# EAGLE design module-basic-ui (EAGLE 7.7.0)
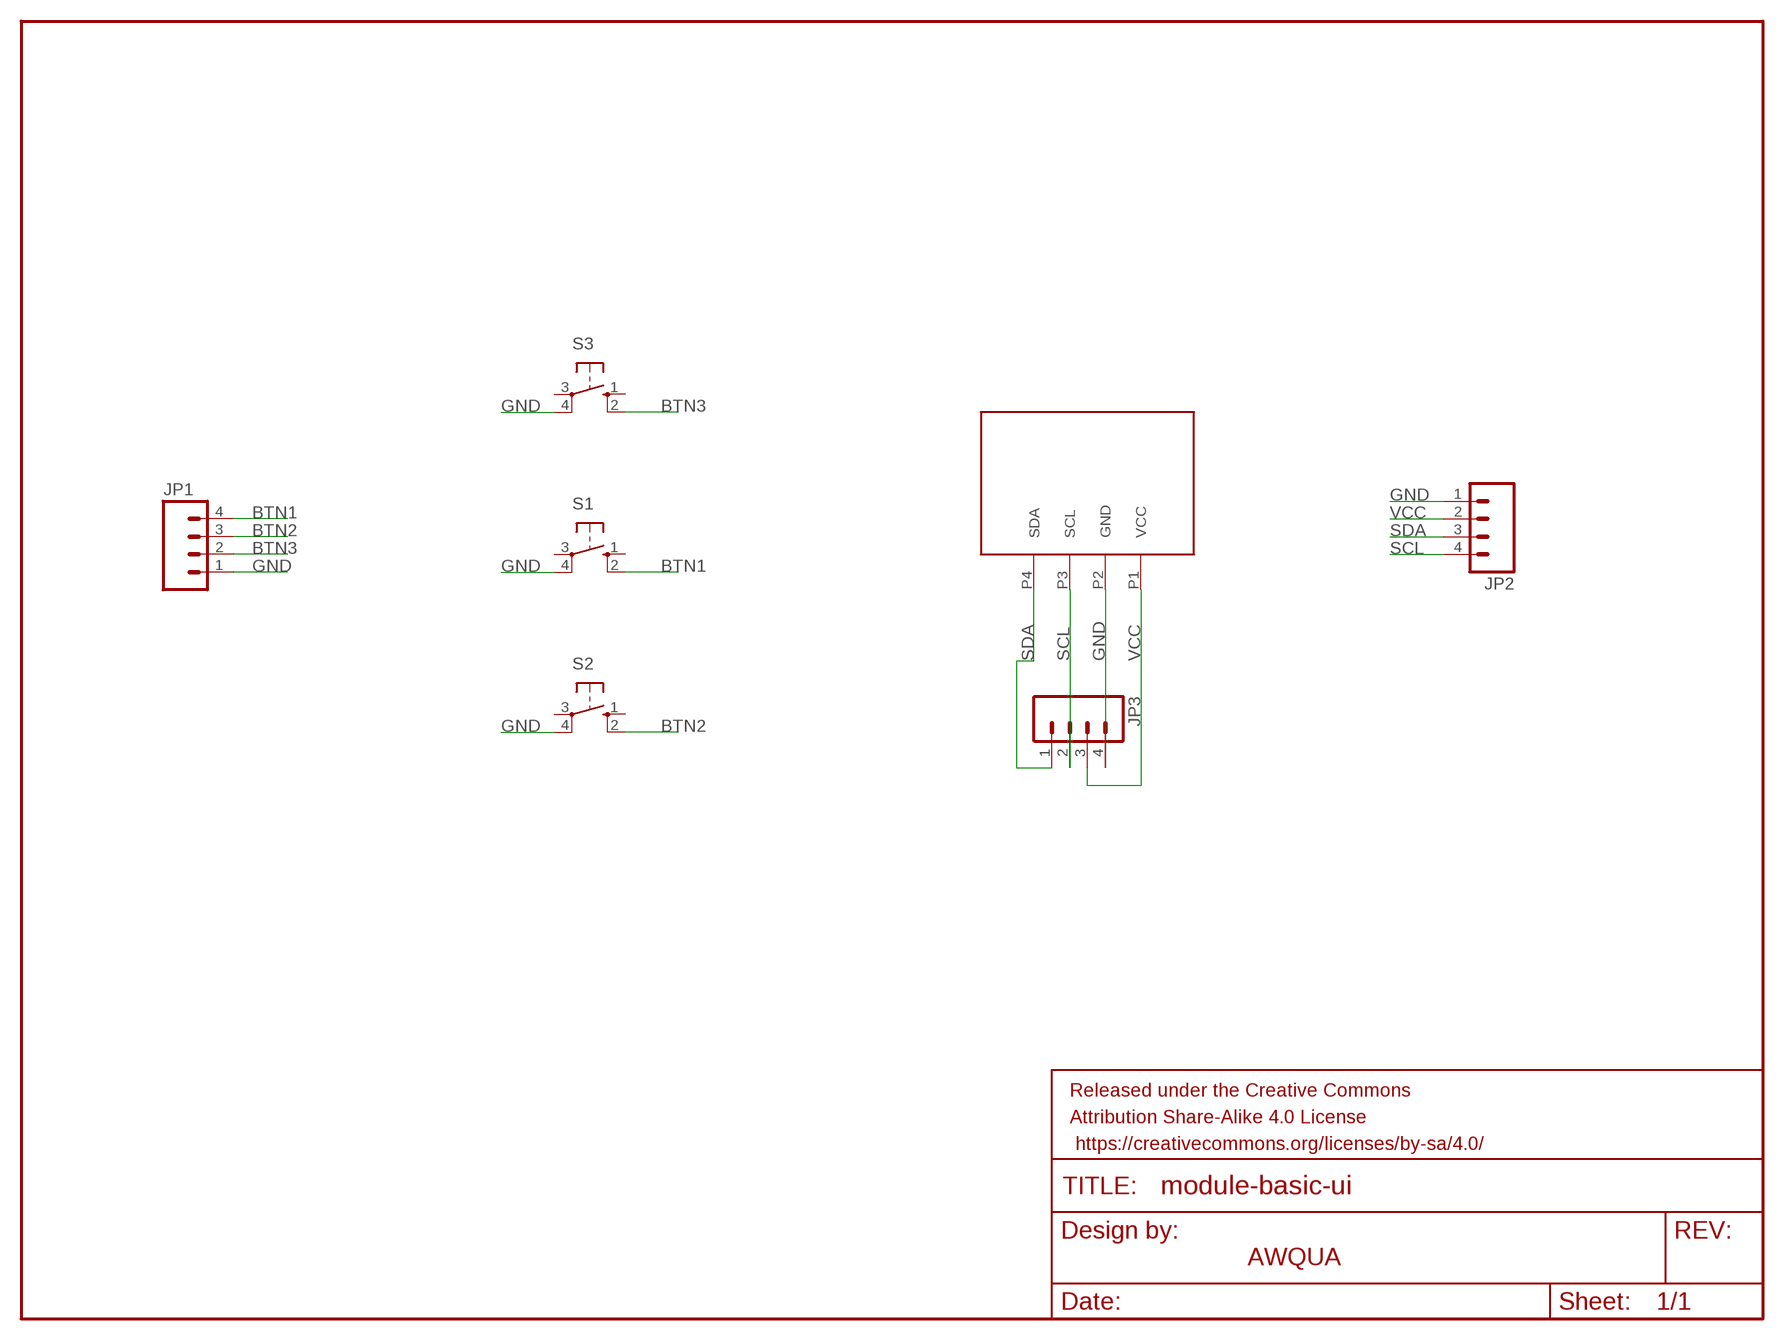
[diagram p0: schematic, sheet 1]

## Parts
FRAME1  FRAME-LETTER  [CREATIVE_COMMONS]
JP1  M04PTH  [1X04]
JP2  M04PTH  [1X04]
JP3  M04PTH  [1X04]
S1  40-XX  [B3F-40XX]
S2  40-XX  [B3F-40XX]
S3  40-XX  [B3F-40XX]
U$2  I2C-OLED-096  [I2C-OLED-096]

## Nets
BTN1: JP1.4 S1.2(S1)
BTN2: JP1.3 S2.2(S1)
BTN3: JP1.2 S3.2(S1)
GND: JP1.1 JP2.1 JP3.4 S1.4(P1) S2.4(P1) S3.4(P1) U$2.P2(GND)
SCL: JP2.4 JP3.2 U$2.P3(SCL)
SDA: JP2.3 JP3.1 U$2.P4(SDA)
VCC: JP2.2 JP3.3 U$2.P1(VCC)
Unconnected: S1.1(S) S1.3(P) S2.1(S) S2.3(P) S3.1(S) S3.3(P)

## Notes on the sheet
- AWQUA

## Library data of the parts
FRAME1 = SparkFun-Aesthetics:FRAME-LETTER: Schematic Frame Standard 8.5x11 US Letter frame
JP1-JP3 = SparkFun-Connectors:M04: Header 4 Standard 4-pin 0.1" header. Use with straight break away headers (SKU : PRT-00116), right angle break away headers (PRT-00553), swiss pins (PRT-00743), machine pins (PRT-00117), and female headers (PRT-00115). Molex polarized connector foot print use with SKU : PRT-08231 with associated crimp pins and housings. 1MM SMD Version SKU: PRT-10208
S1-S3 = adafruit:40-XX: OMRON SWITCH; MF: OMRON COMPONENTS USA; MPN: B3F-4000; OC_FARNELL: 176434; OC_NEWARK: 36K3105
U$2 = awqua_eagle_library:I2C-OLED-096

## Board
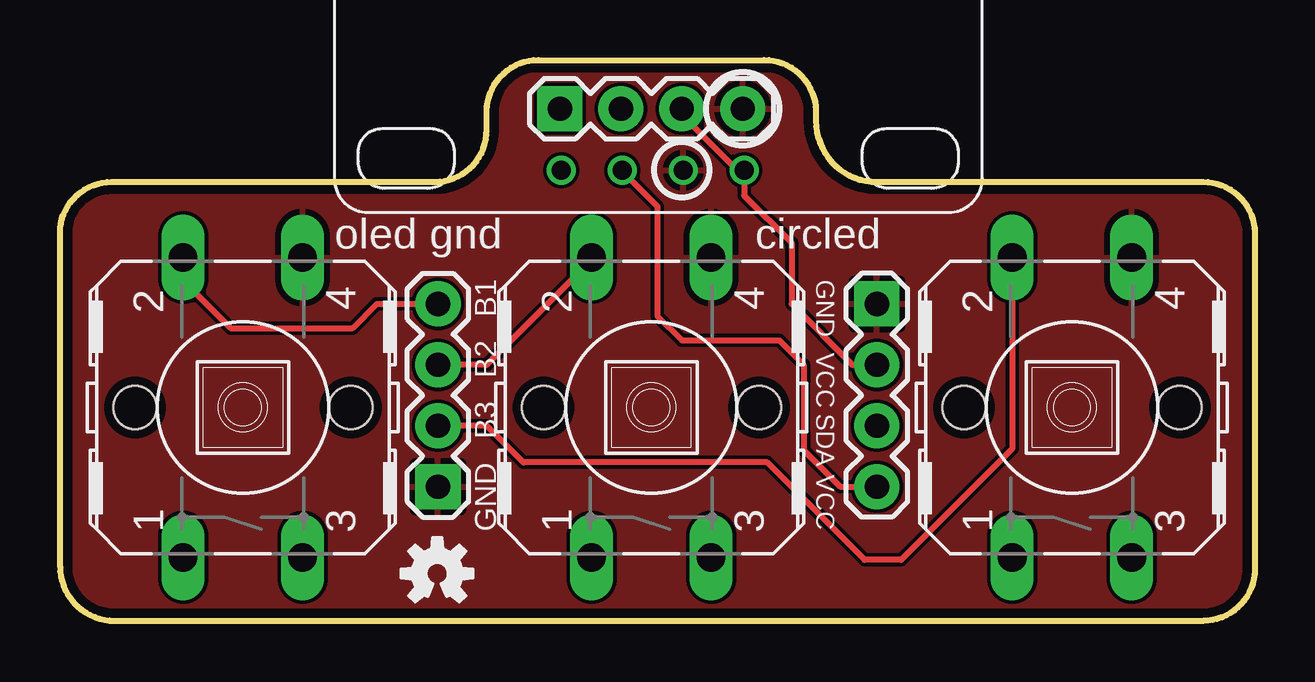
[diagram p1: board, top side]
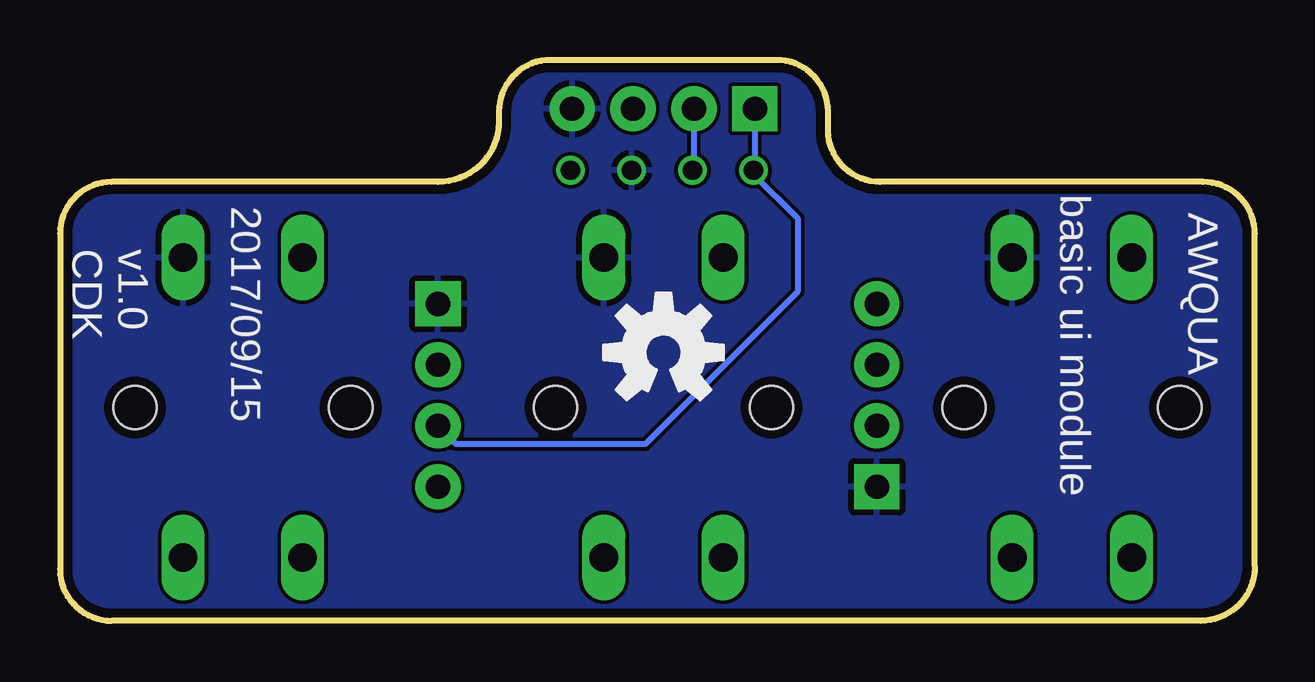
[diagram p2: board, bottom side, seen from below]

Size 49.78 x 23.37 mm. Coordinates in mm from the lower left corner, seen from the top.
Outline: 17.78,20.44 17.78,21.21 arc-90 19.93,23.37 29.34,23.37 arc-90 31.5,21.21 31.5,20.83 arc90 34.04,18.29 47.63,18.29 arc-90 49.78,16.13 49.78,2.15 arc-90 47.63,0 2.27,0 arc-90 0,2.27 0,16.13 arc-90 2.15,18.29 15.62,18.29 arc90 17.78,20.44
Copper layers (1*16): Top 0.0356mm / dielectric 1.5011mm / Bottom 0.0356mm
Design rules "default *": minimum track width 6mil, minimum drill 13mil, track to track 6mil, track to pad 6mil, pad to pad 6mil, via to via 6mil, smd to smd 6mil, copper to edge 15mil, drill to drill 6mil, minimum pad ring 7mil, minimum via ring 7mil, stop-mask expansion 4mil, vias tented up to drill 15mil, thermal gap 10mil

### Footprints (pad centres in the part's own frame; a part is rotated, then mirrored left to right if it is on the bottom)
1X04 = drill 1.016 pad 1.88 square: 1 0,0 | drill 1.016 pad 1.88: 2 2.54,0; 3 5.08,0; 4 7.62,0
B3F-40XX = drill 1.194 long: 1 -6.248,2.489; 2 6.248,2.489; 3 -6.248,-2.489; 4 6.248,-2.489 | hole 1.803: 0,-4.496; 0,4.496
I2C-OLED-096 = drill 0.8: P1 9.59,24.92; P2 12.13,24.92; P3 14.67,24.92; P4 17.21,24.92

### Placement (x,y rotation side)
FRAME1  -4.32,-16.26 0 top  (outside the outline)
JP1  15.75,5.59 90 top
JP2  34.04,13.21 270 top
JP3  20.83,21.34 0 top
S1  7.62,8.89 90 top
S2  24.64,8.89 90 top
S3  42.16,8.89 90 top
U$1  [OSHW-LOGO-S]  15.72,1.97 0 top
U$2  38.1,43.69 180 top
U$4  [OSHW-LOGO-M]  24.64,11.18 0 bottom

### Tracks (layer width: path | path; a pad name or v marks a point on that pad's centre or on a via)
BTN1
  Top 0.254: S1.2 5.13,14.17 7.11,12.19 12.19,12.19 13.21,13.21 JP1.4
BTN2
  Top 0.254: S2.2 22.15,15.04 17.78,10.67 JP1.3
BTN3
  Top 0.254: S3.2 39.67,7.16 35.05,2.54 33.53,2.54 29.46,6.6 19.3,6.6 17.78,8.13 JP1.2
GND
  pour Top: -1.52,26.67 50.8,26.92 50.8,-0.76 -1.52,-1.02
  pour Bottom: -0.51,26.16 50.55,26.42 50.29,-0.76 -1.02,-0.25
SCL
  Top 0.254: U$2.P3 23.43,18.73 24.89,17.27 24.89,12.7 25.91,11.68 29.97,11.68 30.99,10.67 30.99,7.11 32.51,5.59 JP2.4
  Bottom 0.254: JP3.2 23.37,18.83 U$2.P3
SDA
  Bottom 0.254: JP2.3 33.27,7.37 25.4,7.37 19.05,13.72 19.05,16.76 20.89,18.6 U$2.P4 20.83,18.83 JP3.1
VCC
  Top 0.254: JP2.2 33.02,10.67 30.48,13.21 30.48,15.75 28.51,17.72 U$2.P1 28.48,18.8 28.19,18.8 25.91,21.08 JP3.3

### Text on the board
tNames: oled gnd | circled | B1 | GND | B2 | VCC | B3 | SDA | GND | VCC | AWQUA
bNames: basic ui module | AWQUA | 2017/09/15 | v1.0 / CDK